# Altium schematic sheet HRT.SchDoc
size A; SheetNumber: 7; SheetTotal: 9
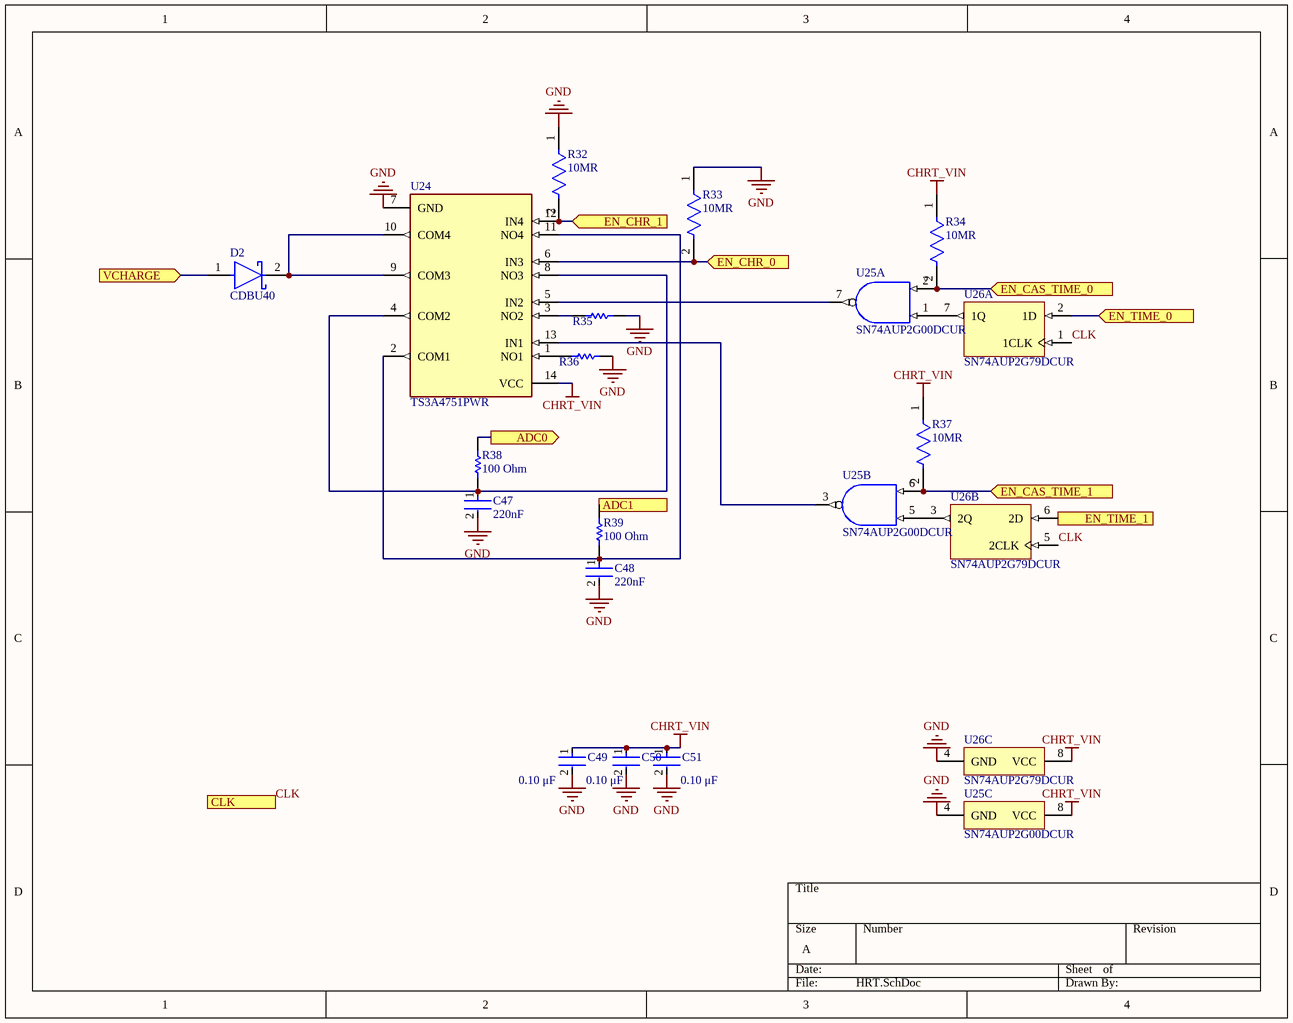
[diagram p0: HRT.SchDoc]

## Parts
C47  Capacitance: 220nF  [FP-GRM155-0_05-IPC_C]  (hidden comment: GRM155R71C224KA12D)
C48  Capacitance: 220nF  [FP-GRM155-0_05-IPC_C]  (hidden comment: GRM155R71C224KA12D)
C49  Capacitance: 0.10 μF  [FP-C0402-BB-MFG]  (hidden comment: C0402C104K8PACTU)
C50  Capacitance: 0.10 μF  [FP-C0402-BB-MFG]  (hidden comment: C0402C104K8PACTU)
C51  Capacitance: 0.10 μF  [FP-C0402-BB-MFG]  (hidden comment: C0402C104K8PACTU)
D2  CDBU40  [FP-S8-V-3880_02-001-MFG]
R32  Resistance: 10MR  [FP-CRCW0402-e3-IPC_C]  (hidden comment: CRCW040210M0JNED)
R33  Resistance: 10MR  [FP-CRCW0402-e3-IPC_C]  (hidden comment: CRCW040210M0JNED)
R34  Resistance: 10MR  [FP-CRCW0402-e3-IPC_C]  (hidden comment: CRCW040210M0JNED)
R35  CRCW040222R0FKED  [RESC1005X40X25LL05T05]  (value not drawn)
R36  CRCW040222R0FKED  [RESC1005X40X25LL05T05]  (value not drawn)
R37  Resistance: 10MR  [FP-CRCW0402-e3-IPC_C]  (hidden comment: CRCW040210M0JNED)
R38  Resistance: 100 Ohm  [RESC1005X40X25LL05T05]  (hidden comment: ERJ-2RKF1000X)
R39  Resistance: 100 Ohm  [RESC1005X40X25LL05T05]  (hidden comment: ERJ-2RKF1000X)
U24  TS3A4751PWR  [FP-PW0014A-IPC_C]
U25  SN74AUP2G00DCUR  [DCU0008A_L]  (parts A,B,C of 3)
U26  SN74AUP2G79DCUR  [DCU0008A_L]  (parts A,B,C of 3)

## Ports
ADC0 (out), ADC1 (out), CLK (in), EN_CAS_TIME_0 (in), EN_CAS_TIME_1 (in), EN_CHR_0 (in), EN_CHR_1 (in), EN_TIME_0 (in), EN_TIME_1 (in), VCHARGE (in)

## Nets
CHRT_VIN: C49.1 C50.1 C51.1 R34.1 R37.1 U24.14(VCC) U25.8(VCC) U26.8(VCC)
GND: C47.2 C48.2 C49.2 C50.2 C51.2 R32.1 R33.1 R35.2 R36.2 U24.7(GND) U25.4(GND) U26.4(GND)
ADC0: R38.2 ; port ADC0
ADC1: R39.2 ; port ADC1
CLK: U26.1(1CLK) U26.5(2CLK) ; port CLK
EN_CAS_TIME_0: R34.2 U25.2(1B) ; port EN_CAS_TIME_0
EN_CAS_TIME_1: R37.2 U25.6(2B) ; port EN_CAS_TIME_1
EN_CHR_0: R33.2 U24.6(IN3) ; port EN_CHR_0
EN_CHR_1: R32.2 U24.12(IN4) ; port EN_CHR_1
EN_TIME_0: U26.2(1D) ; port EN_TIME_0
EN_TIME_1: U26.6(2D) ; port EN_TIME_1
VCHARGE: D2.1(A) ; port VCHARGE
NetC47_1: C47.1 R38.1 U24.4(COM2) U24.8(NO3)
NetC48_1: C48.1 R39.1 U24.2(COM1) U24.11(NO4)
NetD2_2: D2.2(C) U24.9(COM3) U24.10(COM4)
NetR35_1: R35.1 U24.3(NO2)
NetR36_1: R36.1 U24.1(NO1)
NetU24_5: U24.5(IN2) U25.7(1Y)
NetU24_13: U24.13(IN1) U25.3(2Y)
NetU25_1: U25.1(1A) U26.7(1Q)
NetU25_5: U25.5(2A) U26.3(2Q)

## Library data of the parts
C47 C48 = CMP-1034-02089-3: Chip Multilayer Ceramic Capacitors for General Purpose, 0402, 0.22uF, X7R, 15%, 10%, 16V; Depth: 0.5mm; Dielectric: X7R; Min Operating Temperature: -55°C; Package Quantity: 1; Termination: SMD/SMT; Mount: Surface Mount; Radiation Hardening: No; Height: 0.5mm; Case Code (Metric): 1005; Packaging: Tape and Reel; Material: Ceramic; Voltage: 16V; Voltage Rating (DC): 16V; REACH SVHC: No SVHC; Voltage Rating: 16V; Length: 1mm; Tolerance: 10%; Thickness: 0.022inch; Case Code (Imperial): 0402; Max Operating Temperature: 125°C; Width: 0.02inch; Lead Free: Lead Free; Case/Package: 0402
C49-C51 = CMP-2008-02046-2: CAP CER 0.1UF 10V X5R 0402; Manufacturer: Kemet; Material: Ceramic; Temperature Coefficient: 15%; Tolerance: 0.1; Value: 0.10 μF; Package: C0402-BB; Temperature: -55°C to +125°C; ComponentLink2Description: Datasheet; Temperature Characteristic: X5R; Device Class L1: Passive Components; Height: 0.55mm; Lead Free: Yes; ComponentLink2URL: https://content.kemet.com/datasheets/KEM_C1002_X7R_SMD.pdf; Device Class L2: Capacitors; Temperature Range Low: -55°C; Temperature Range High: +125°C; RoHS: TRUE; Octopart: https://octopart.com/c0402c104k8pactu-kemet-140039; Automotive: No; Mouser Description: Capacitor 100 nF 10 VDC 0402; Category: Cap; Voltage Rating: 10 V; Digikey Description: CAP CER 0.1UF 10V X5R 0402; Ipc Land Pattern Name: CAPC10050X50; Device Class L3: Ceramic Capacitors; Manufacturer Part Number: C0402C104K8PACTU
D2 = CMP-02539-000026-1: DIODE SCHOTTKY 40V 120MA SOD523; Manufacturer: Vishay; Manufacturer Part Number: BAS40-02V-V-G-08; Max Surge Forward Current: 600mA; Max Junction Temp: +125°C; Peak Reverse Current: 0.02uA; Capacitance: 4pF; Value: 4pF; Temperature: to +125°C; Octopart: https://octopart.com/bas40-02v-v-g-08-vishay-44351221; Device Class L3: Schottky Diodes; RoHS: TRUE; Category: Diode; Digikey Description: DIODE SCHOTTKY 40V 120MA SOD523; Forward Current: 120mA; Automotive: No; Mouser Description: BAS40 Series 40 V 120 mA Surface Mount Small Signal Schottky Diode - SOD-523; Package: S8-V-3880.02-001; Device Class L2: Diodes; ComponentLink2URL: https://www.vishay.com/docs/82391/bas4002v.pdf; Temperature Range High: +125°C; Lead Free: Yes; Reverse Voltage: 40V; ComponentLink2Description: Datasheet; Height: 0.7mm; Max Repetitive Reverse Voltage: 40V; Device Class L1: Discrete Semiconductors
R32-R34 R37 = CMP-1011-00170-3: RES Thick Film, 10MΩ, 5%, 0.063W, 200ppm/°C, 0402; Voltage Rating (DC): 50V; Max Power Dissipation: 63mW; Case Code (Metric): 1005; Tolerance: 5%; Lead Free: Lead Free; Length: 1mm; Packaging: Tape and Reel; Depth: 0.5mm; Composition: Thick Film; Temperature Coefficient: 200ppm/°C; Package Quantity: 1; Radiation Hardening: No; Weight: 2.3E-05oz; Width: 0.5mm; Military Standard: Not; Power Rating: 63mW; Case/Package: 0402; Termination: SMD/SMT; Height: 0.016inch; Voltage Rating: 50V; Contact Plating: Tin; Number of Terminations: 2; Features: Automotive AEC-Q200; Max Operating Temperature: 155°C; Case Code (Imperial): 0402; Min Operating Temperature: -55°C
R35 R36 = CMP-2002-08382-1: Manufacturer: Vishay Dale; Part Number: CRCW040222R0FKED
R38 R39 = CMP-2002-00605-3: Chip Resistor, 100 Ohm, +/- 1%, 100 mW, -55 to 155 degC, 0402 (1005 Metric), RoHS, Tape and Reel; Manufacturer: Basic Passives; Power Rating: 100 mW; Voltage Rating: 50 V; Case\/Package: 0402; Width: 0.5 mm; Pins: 2; ComponentLink2Description: Datasheet; PackageReference: 0402; Height: 0.35 mm; Tolerance: 1%; DatasheetVersion: 04/2015; Case Code (Imperial): 0402; Min Operating Temperature: -55 degC; Radiation Hardening: No; Length: 1 mm; Package Quantity: 10000; PackageDescription: 2-Pin Surface Mount Device, Body 1 x 0.5 mm; Mounting Technology: Surface Mount; Case Code (Metric): 1005; Packaging: Tape and Reel; ComponentLink1URL: http://www.panasonic.com/; RoHSCompliant: true; Max Operating Temperature: 155 degC; REACH SVHC: Yes; PartNumber: ERJ-2RKF1000X; ComponentLink1Description: Manufacturer URL; ComponentLink2URL: http://industrial.panasonic.com/cdbs/www-data/pdf/RDA0000/AOA0000C86.pdf; Mount: Surface Mount
U24 = CMP-04892-000059-1: IC SWITCH QUAD SPST 14TSSOP; Bandwidth: 125MHz; High Level Output Current: 100mA; Max Supply Voltage: 3.6V; Operating Supply Voltage: 3V; Polarity: Non-Inverting; Turn-Off Delay Time: 9ns; On-State Resistance: 900mR; Supply Type: Single; Max Supply Current: 75nA; Number of Inputs: 4; Turn-On Delay Time: 14ns; Min Supply Voltage: 1.6V; Packaging: Tape and Reel; Contact Plating: Gold; Mount: Surface Mount; Low Level Output Current: 100mA; Termination: SMD/SMT; Min Operating Temperature: -40°C; Case/Package: TSSOP; REACH SVHC: No SVHC; Weight: 0.002018oz; Number of Pins: 14; Throw Configuration: SPST; Height: 1.05mm; Radiation Hardening: No; Length: 5.1mm; Max Operating Temperature: 85°C; Package Quantity: 1; Lead Free: Lead Free; RoHS Compliant: Yes; Number of Channels: 4; Number of Outputs: 4; Width: 4.5mm
U25 = CMP-0859-00590-3: Low-Power Dual 2-Input Positive-NAND Gate, DCU0008A, LARGE T&R; Manufacturer: Texas Instruments; tpd @ Nom Voltage(Max)(ns): 31.8,26.3,16.6,12.9,8.8,6.7; 3-State Output: No; Rating: Catalog; Output Type: CMOS; Bits(#): 2; ICC @ Nom Voltage(Max)(mA): 0.0009; Gate Type: NAND; F @ Nom Voltage(Max)(Mhz): 100; Output Drive (IOL/IOH)(Max)(mA): 20/-20; VCC(Min)(V): 0.8; Logic: True; VCC(Max)(V): 3.6; Technology Family: AUP; Voltage(Nom)(V): 0.8,1.2,1.5,1.8,2.5,3.3; Sub-Family: NAND Gate; Generic Part Number: SN74AUP2G00; PackageReference: DCU0008A; Schmitt Trigger: No; Input Type: CMOS; DatasheetVersion: SCES752C; Operating Temperature Range(C): -40 to 85
U26 = CMP-0859-00716-3: Low-Power Dual Positive-Edge-Triggered D-Type Flip-Flop, DCU0008A, LARGE T&R; Manufacturer: Texas Instruments; ICC @ Nom Voltage(Max)(mA): 0.0009; 3-State Output: No; Input Type: CMOS; Rating: Catalog; Output Drive (IOL/IOH)(Max)(mA): 20/-20; VCC(Max)(V): 3.6; Bits(#): 2; Technology Family: AUP; Logic: True; Voltage(Nom)(V): 0.8,1.2,1.5,1.8,2.5,3.3; VCC(Min)(V): 0.8; tpd @ Nom Voltage(Max)(ns): 27.2,17.3,13.3,11.3,7.8,6.3; F @ Nom Voltage(Max)(Mhz): 100; DatasheetVersion: SCES755C; Generic Part Number: SN74AUP2G79; Sub-Family: D-Type Flip-Flop; PackageReference: DCU0008A; Schmitt Trigger: No; Output Type: CMOS; Operating Temperature Range(C): -40 to 85